# EasyEDA Pro project PRJ_Feeder_V01c.epro, schematic Photo
Board Name: Photo; Create Date: 2025-04-08; Page Name: Photo; Project Name: Orion-Feeder; Schematic Name: Photo; Update Date: 2025-04-08; Company: EasyEDA.com; Page Size: A4; Version: V1.0
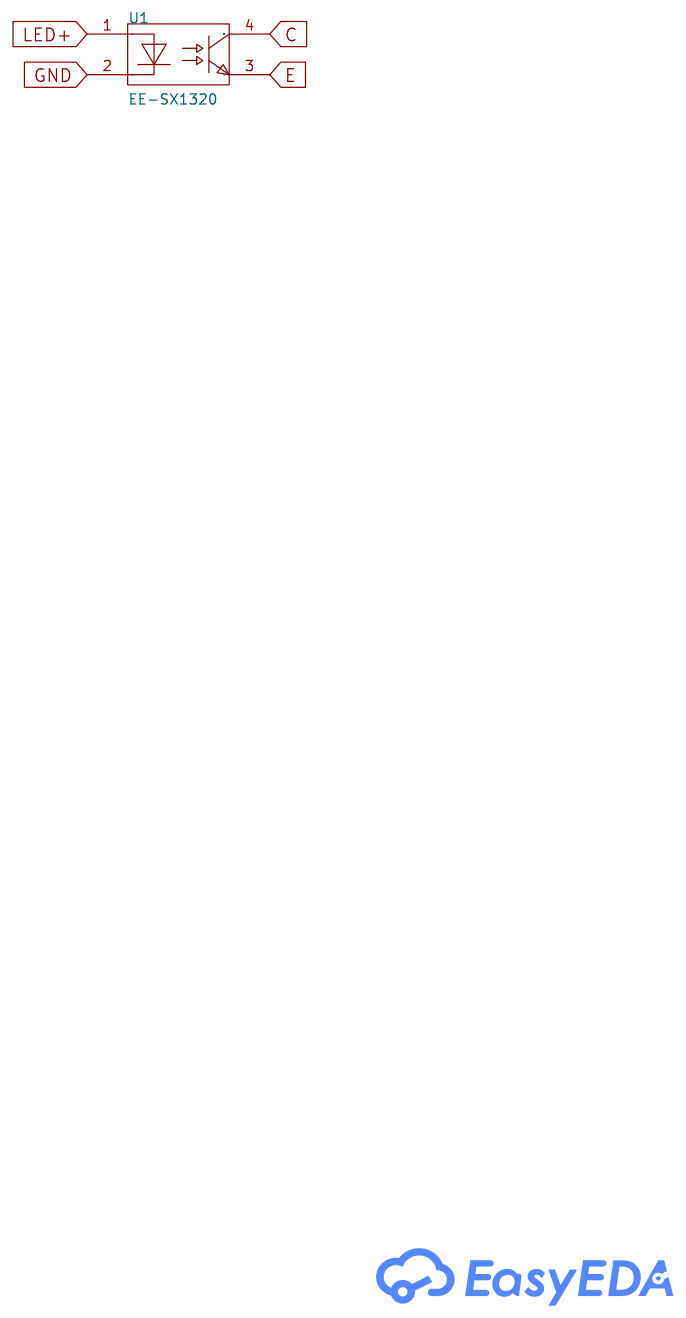
[diagram p4: schematic sheet]

## Parts
U1  EE-SX1320  [OPTO-SMD-4_EE-SX1320]

## Library data of the parts
U1 = EE-SX1320: Slot Width:2mm Output Current:20mA; LCSC Part Name: 2mm 超紧凑型插槽; Supplier Part: C469121; Manufacturer: OMRON(欧姆龙); Supplier Footprint: SMD; JLCPCB Part Class: Extended Part; Supplier: LCSC; Slot Width: 2mm; Output Current: 20mA

## Nets
GND: U1.2(C)
C: U1.4(C)
E: U1.3(E)
LED+: U1.1(A)
